# EAGLE design 0126-fetz4-lp (EAGLE 9.6.2)
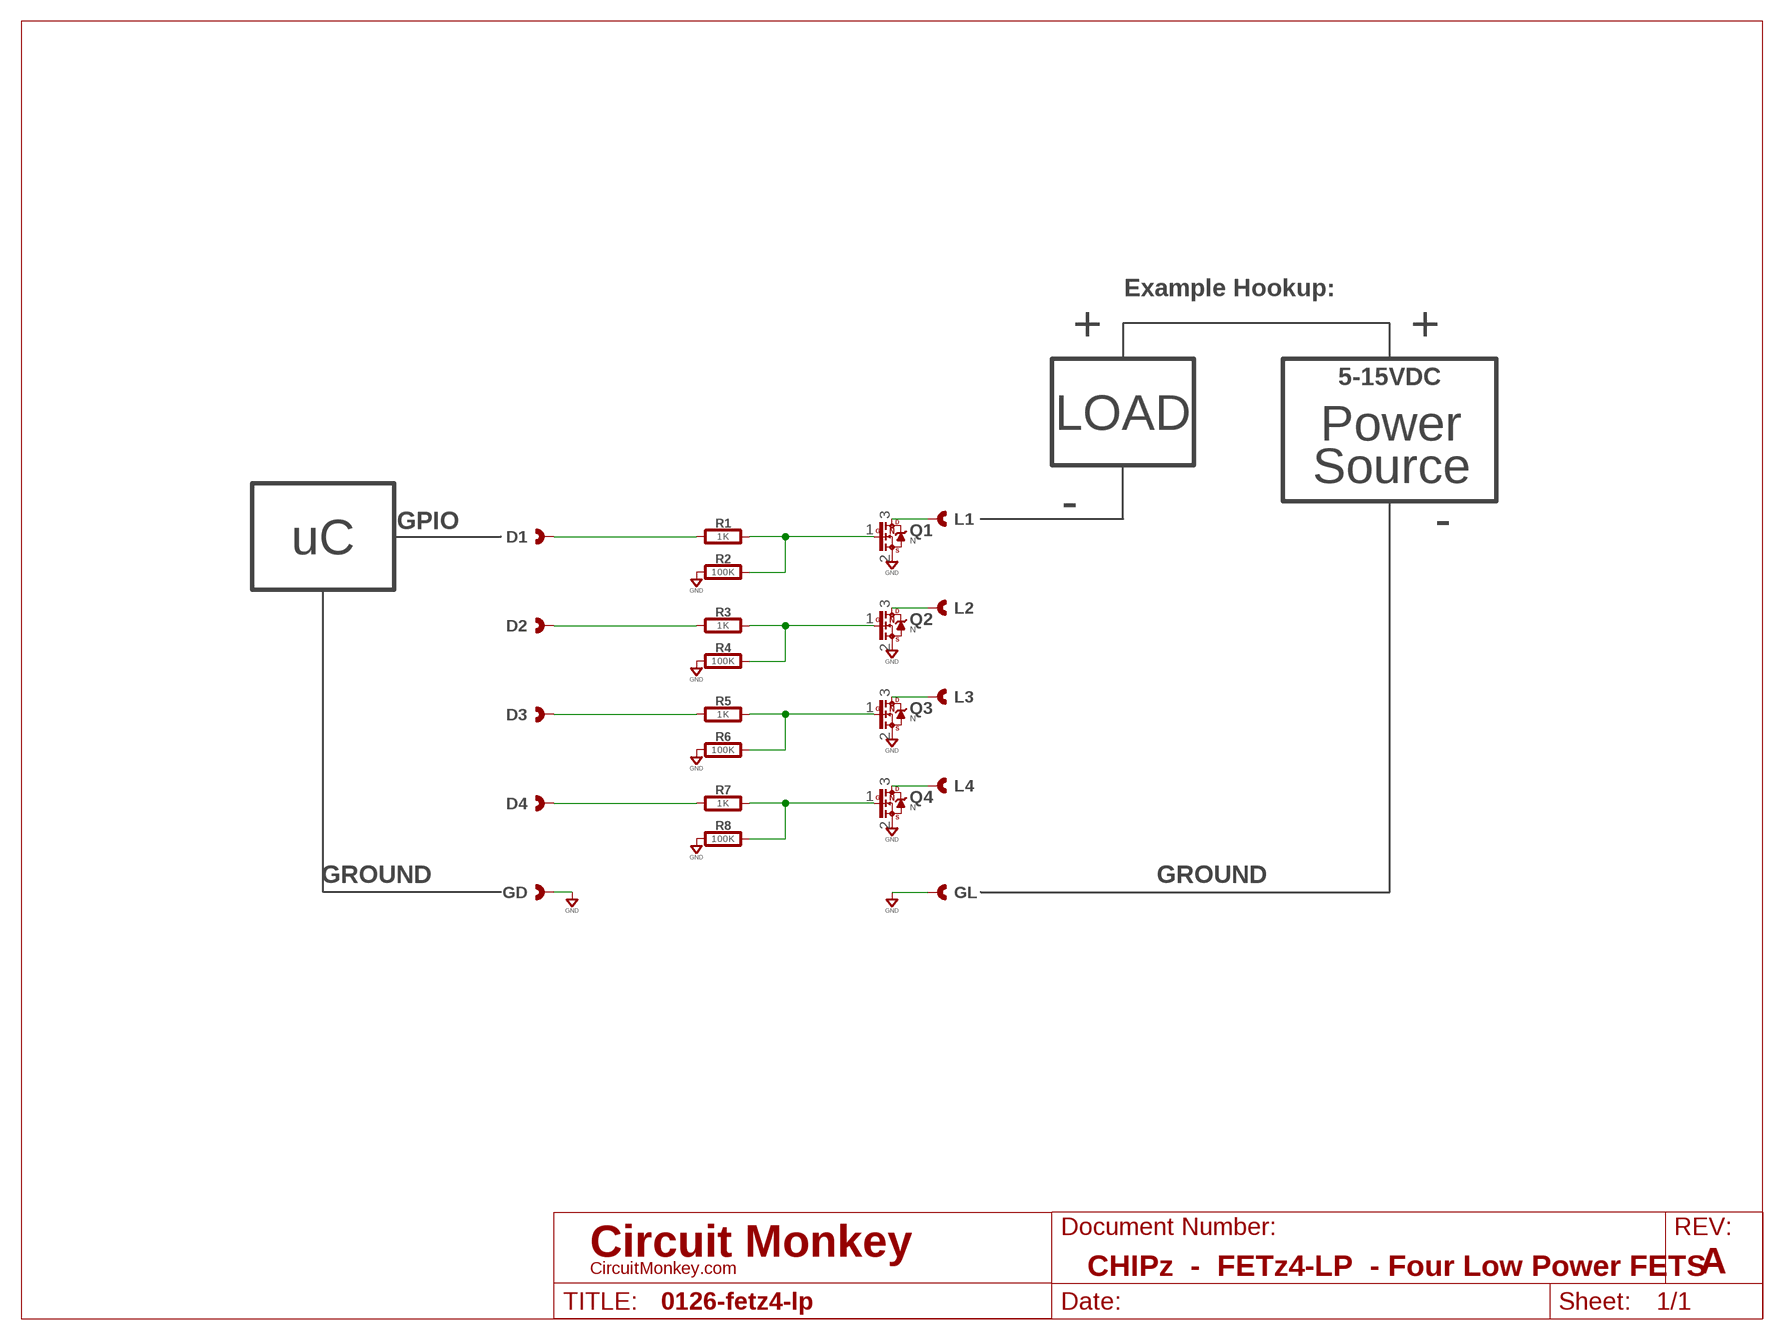
[diagram p0: schematic, sheet 1]
SHEET1 (LETTER_L-CIRCUITMONKEY): DOCUMENT_NUMBER: CHIPz - FETz4-LP - Four Low Power FETS; REV: A

## Parts
D1  CAST-01X12.00MM  [CAST01-2.00MM]
D2  CAST-01X12.00MM  [CAST01-2.00MM]
D3  CAST-01X12.00MM  [CAST01-2.00MM]
D4  CAST-01X12.00MM  [CAST01-2.00MM]
GD  CAST-01X12.00MM  [CAST01-2.00MM]
GL  CAST-01X12.00MM  [CAST01-2.00MM]
L1  CAST-01X12.00MM  [CAST01-2.00MM]
L2  CAST-01X12.00MM  [CAST01-2.00MM]
L3  CAST-01X12.00MM  [CAST01-2.00MM]
L4  CAST-01X12.00MM  [CAST01-2.00MM]
Q1  N  N-FET_SI2318A  [SOT-23]
Q2  N  N-FET_SI2318A  [SOT-23]
Q3  N  N-FET_SI2318A  [SOT-23]
Q4  N  N-FET_SI2318A  [SOT-23]
R1  1K  RESISTOR0603  [0603-RES]
R2  100K  RESISTOR0603  [0603-RES]
R3  1K  RESISTOR0603  [0603-RES]
R4  100K  RESISTOR0603  [0603-RES]
R5  1K  RESISTOR0603  [0603-RES]
R6  100K  RESISTOR0603  [0603-RES]
R7  1K  RESISTOR0603  [0603-RES]
R8  100K  RESISTOR0603  [0603-RES]

## Nets
GND: GD.1 GD.P$1 GD.P$2 GL.1 GL.P$1 GL.P$2 Q1.2(S) Q2.2(S) Q3.2(S) Q4.2(S) R2.1 R4.1 R6.1 R8.1
N$1: L1.1 L1.P$1 L1.P$2 Q1.3(D)
N$2: D1.1 D1.P$1 D1.P$2 R1.1
N$3: Q1.1(G) R1.2 R2.2
N$4: L2.1 L2.P$1 L2.P$2 Q2.3(D)
N$5: D2.1 D2.P$1 D2.P$2 R3.1
N$6: Q2.1(G) R3.2 R4.2
N$7: L3.1 L3.P$1 L3.P$2 Q3.3(D)
N$8: D3.1 D3.P$1 D3.P$2 R5.1
N$9: Q3.1(G) R5.2 R6.2
N$10: L4.1 L4.P$1 L4.P$2 Q4.3(D)
N$11: D4.1 D4.P$1 D4.P$2 R7.1
N$12: Q4.1(G) R7.2 R8.2

## Notes on the sheet
- Example Hookup:
- + | +
- 5-15VDC
- LOAD
- Power
  Source
- -
- GPIO | -
- uC
- GROUND | GROUND

## Library data of the parts
D1-D4 GD GL L1-L4 = con-headers:CAST-01X1: Castelated Edge Hole Pad
Q1-Q4 = transistor-fet:N-FET: FET; COST01: 0.38; COST10: 0.30; COST100: 0.18; IDS: 5A; MPN: S2318A; RDS: 0.45mOhms
R1-R8 = rlc:RESISTOR: Resistor; COST01: 0.10; COST10: 0.05; COST100: 0.02

## Board
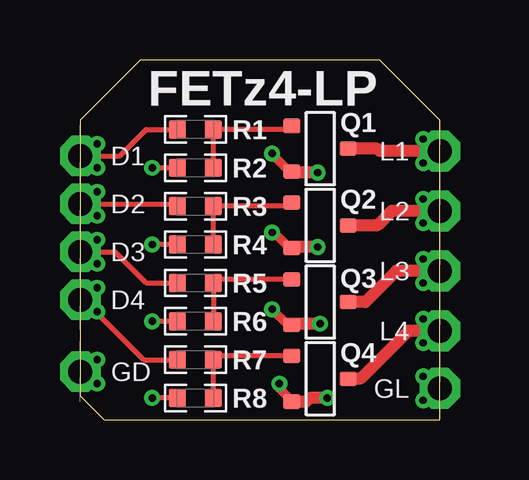
[diagram p1: board, top side]
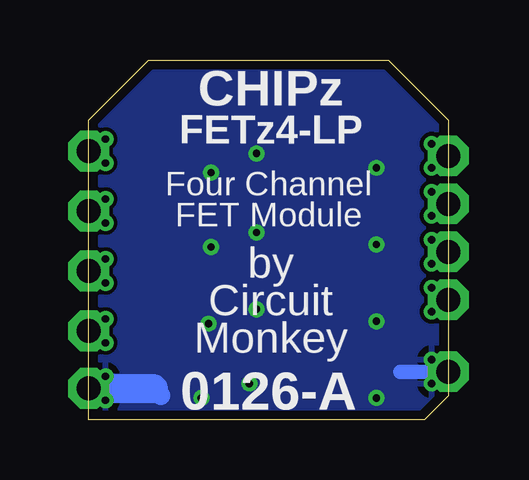
[diagram p2: board, bottom side, seen from below]

Size 15 x 15 mm. Coordinates in mm from the lower left corner, seen from the top.
Outline: 1,0 15,0 15,12.5 12.5,15 2.5,15 0,12.5 0,1 1,0
Copper layers (1*16): Top 0.0356mm / dielectric 1.5011mm / Bottom 0.0356mm
Design rules "OSH-CircuitMonkey *": minimum track width 6mil, minimum drill 12mil, track to track 6mil, track to pad 6mil, pad to pad 6mil, via to via 6mil, smd to smd 6mil, copper to edge 15mil, drill to drill 6mil, minimum pad ring 7mil, minimum via ring 7mil, stop-mask expansion 3mil, vias tented up to drill 13mil, thermal gap 10mil

### Footprints (pad centres in the part's own frame; a part is rotated, then mirrored left to right if it is on the bottom)
CAST01-2.00MM = drill 1 pad 1.7 octagon: 1 0,0 | drill 0.305: P$1 -0.7,0.5; P$2 -0.7,-0.5
SOT-23 = smd 0.6 x 0.7: 1 -0.95,-1.18; 2 0.95,-1.18; 3 0,1.18
0603-RES = smd 0.711 x 0.762: 1 -0.752,0; 2 0.752,0

### Placement (x,y rotation side)
D1  0,11 180 top
D2  0,9 180 top
D3  0,7 180 top
D4  0,5 180 top
GD  0,2 180 top
GL  15,1.3 0 top
L1  15,11.2 0 top
L2  15,8.7 0 top
L3  15,6.2 0 top
L4  15,3.7 0 top
Q1  10,11.3 270 top
Q2  10,8.1 270 top
Q3  10,4.9 270 top
Q4  10,1.7 270 top
R1  4.8,12.1 0 top
R2  4.8,10.5 0 top
R3  4.8,8.9 0 top
R4  4.8,7.3 0 top
R5  4.8,5.7 0 top
R6  4.8,4.1 0 top
R7  4.8,2.5 0 top
R8  4.8,0.9 0 top

### Tracks (layer width: path | path; a pad name or v marks a point on that pad's centre or on a via)
GND  (via drill 0.3)
  Top 0.2: 0.2,2 GD.P$2 | GD.1 0.2,2 | 0.2,2 GD.P$1 | R2.1 v3,10.5 | R4.1 v3,7.3 | R6.1 v3,4.1 | R8.1 v3,0.9 | 14.8,1.3 GL.P$1 | GL.1 14.8,1.3 | 14.8,1.3 GL.P$2
  Top 0.4: v8,11.1 8,11.07 8.72,10.35 Q1.2 | Q2.2 8.72,7.15 8.07,7.8 v8,7.8 | Q3.2 8.65,3.95 v8,4.6 | Q4.2 8.82,0.78 8.3,1.3 v8.3,1.5
  Top 0.5: v9.9,10.3 8.87,10.3 Q1.2 | v9.9,7.2 8.87,7.2 Q2.2 | v10,4 8.87,4 Q3.2 | v10.3,0.9 9.57,0.9 9.42,0.75 Q4.2
  Bottom 0.6: GD.1 2,2
  Bottom 0.8: 12.3,1.3 12,1
  Bottom 1.2: GL.1 12.3,1.3
  pour Bottom: 15,0 1,0 0,1 0,12.5 2.5,15 12.5,15 15,12.5
N$1
  Top 0.2: 14.8,11.2 L1.P$1 | L1.1 14.8,11.2 | 14.8,11.2 L1.P$2
  Top 0.5: L1.1 12.48,11.2 12.38,11.3 Q1.3
N$2
  Top 0.2: 0.2,11 D1.P$1 | 0.2,11 D1.1 1.65,11 2.75,12.1 R1.1 | 0.2,11 D1.P$2
N$3
  Top 0.2: R2.2 R1.2 8.67,12.1 Q1.1
N$4
  Top 0.2: 14.8,8.7 L2.P$1 | L2.1 14.8,8.7 | 14.8,8.7 L2.P$2
  Top 0.5: L2.1 12.98,8.7 12.38,8.1 Q2.3
N$5
  Top 0.2: 0.2,9 D2.P$2 | 0.2,9 D2.1 3.95,9 R3.1 | 0.2,9 D2.P$1
N$6
  Top 0.2: R4.2 R3.2 8.67,8.9 Q2.1
N$7
  Top 0.2: 14.8,6.2 L3.P$1 | L3.1 14.8,6.2 | 14.8,6.2 L3.P$2
  Top 0.5: L3.1 13.18,6.2 11.88,4.9 Q3.3
N$8
  Top 0.2: 0.2,7 D3.P$2 | 0.2,7 D3.1 1.45,7 2.75,5.7 R5.1 | 0.2,7 D3.P$1
N$9
  Top 0.2: R6.2 R5.2 5.7,5.85 Q3.1
N$10
  Top 0.2: 14.8,3.7 L4.P$1 | L4.1 14.8,3.7 | 14.8,3.7 L4.P$2
  Top 0.5: L4.1 13.68,3.7 11.68,1.7 Q4.3
N$11
  Top 0.2: 0.2,5 D4.P$2 | 0.2,5 D4.1 0.15,5 2.65,2.5 R7.1 | 0.2,5 D4.P$1
N$12
  Top 0.2: R8.2 R7.2 5.7,2.65 Q4.1

### Text on the board
tPlace: FETz4-LP
bPlace: CHIPz | FETz4-LP | Four Channel / FET Module | by / Circuit / Monkey | 0126-A